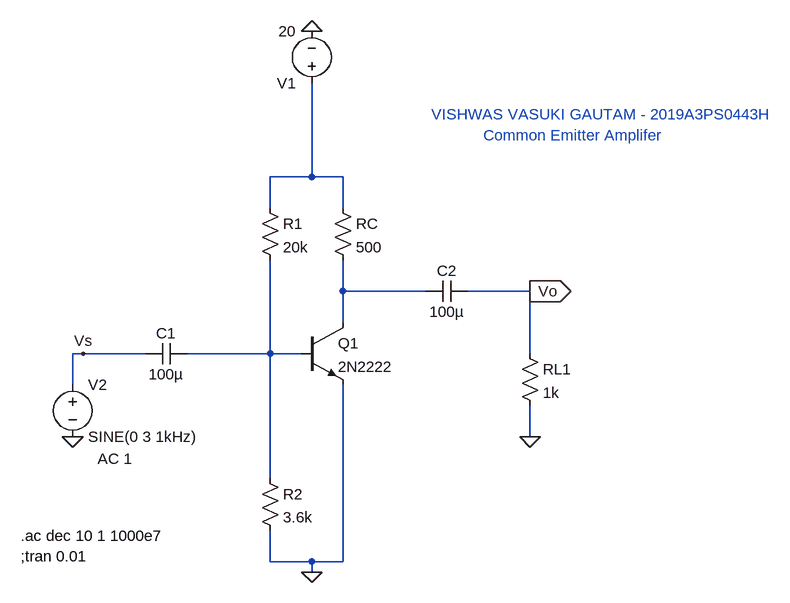
[diagram p0: schematic CE_amplifier.asc]
CE_amplifier.asc, the LTspice schematic file:
Version 4
SHEET 1 880 680
WIRE -208 -384 -208 -528
WIRE -208 -384 -272 -384
WIRE -160 -384 -208 -384
WIRE -272 -336 -272 -384
WIRE -160 -336 -160 -384
WIRE -160 -208 -160 -256
WIRE -32 -208 -160 -208
WIRE 128 -208 32 -208
WIRE -160 -160 -160 -208
WIRE -560 -112 -576 -112
WIRE -464 -112 -560 -112
WIRE -272 -112 -272 -256
WIRE -272 -112 -400 -112
WIRE -224 -112 -272 -112
WIRE 128 -112 128 -208
WIRE -576 -64 -576 -112
WIRE 128 16 128 -32
WIRE -272 80 -272 -112
WIRE -272 208 -272 160
WIRE -208 208 -272 208
WIRE -160 208 -160 -64
WIRE -160 208 -208 208
WIRE -208 224 -208 208
FLAG -576 16 0
FLAG -208 -608 0
FLAG -208 224 0
FLAG 128 -208 Vo
IOPIN 128 -208 Out
FLAG -560 -112 Vs
FLAG 128 16 0
SYMBOL voltage -208 -512 R180
WINDOW 123 0 0 Left 2
WINDOW 39 0 0 Left 2
SYMATTR InstName V1
SYMATTR Value 20
SYMBOL voltage -576 -80 R0
WINDOW 123 38 130 Left 2
WINDOW 39 0 0 Left 2
SYMATTR Value2 AC 1
SYMATTR InstName V2
SYMATTR Value SINE(0 3 1kHz)
SYMBOL cap -400 -128 R90
WINDOW 0 0 32 VBottom 2
WINDOW 3 32 32 VTop 2
SYMATTR InstName C1
SYMATTR Value 100µ
SYMBOL res -288 -352 R0
SYMATTR InstName R1
SYMATTR Value 20k
SYMBOL npn -224 -160 R0
SYMATTR InstName Q1
SYMATTR Value 2N2222
SYMBOL res -288 64 R0
SYMATTR InstName R2
SYMATTR Value 3.6k
SYMBOL cap 32 -224 R90
WINDOW 0 0 32 VBottom 2
WINDOW 3 32 32 VTop 2
SYMATTR InstName C2
SYMATTR Value 100µ
SYMBOL res 112 -128 R0
SYMATTR InstName RL1
SYMATTR Value 1k
SYMBOL res -176 -352 R0
SYMATTR InstName RC
SYMATTR Value 500
TEXT -656 200 Left 2 !;tran 0.01
TEXT -656 168 Left 2 !.ac dec 10 1 1000e7
TEXT -24 -480 Left 2 ;VISHWAS VASUKI GAUTAM - 2019A3PS0443H
TEXT 56 -448 Left 2 ;Common Emitter Amplifer

The netlist it stands for:
* CE_amplifier.asc
V1 N001 0 20
V2 Vs 0 SINE(0 3 1kHz) AC 1
C1 N003 Vs 100µ
R1 N001 N003 20k
Q1 N002 N003 0 0 2N2222
R2 N003 0 3.6k
C2 Vo N002 100µ
RL1 Vo 0 1k
RC N001 N002 500
.model NPN NPN
.model PNP PNP
.lib standard.bjt
;tran 0.01
.ac dec 10 1 1000e7
* VISHWAS VASUKI GAUTAM - 2019A3PS0443H
* Common Emitter Amplifer
.backanno
.end